# EAGLE schematic Nixie 3757 (EAGLE 6.5.0)
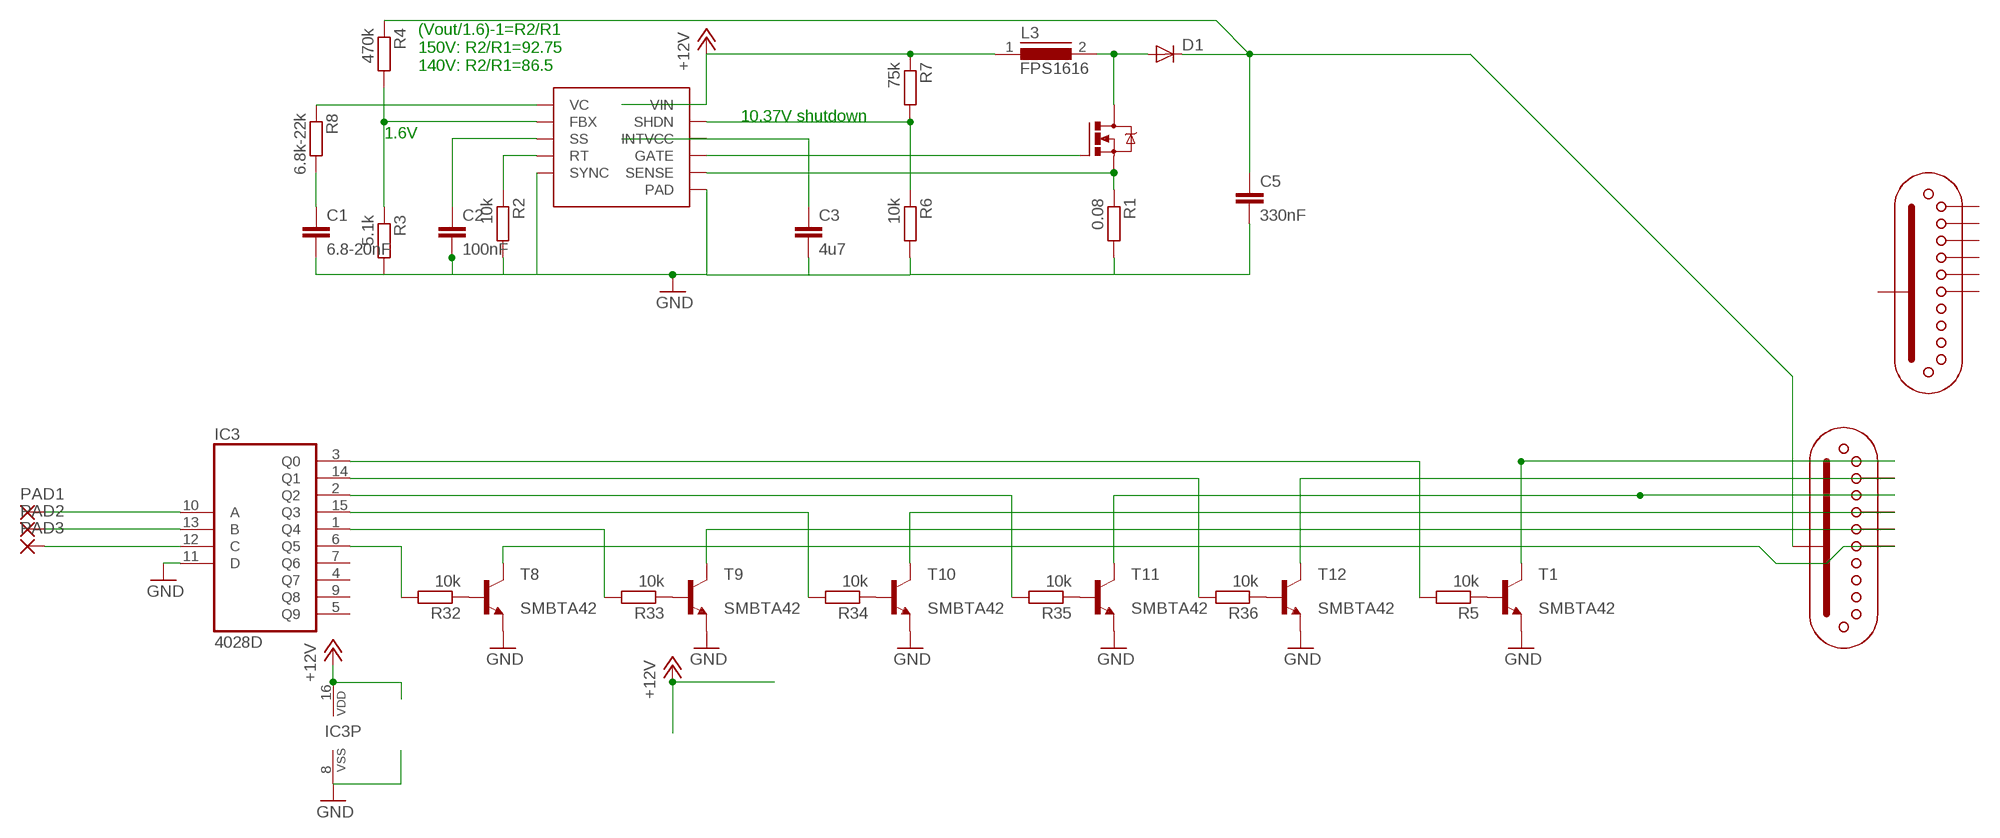
[diagram p0: schematic, sheet 1]

## Parts
C1  6.8-20nF  C-EUC0805K  [C0805K]
C2  100nF  C-EUC0805K  [C0805K]
C3  4u7  C-EUC0805K  [C0805K]
C5  330nF  C-EUC1812  [C1812]
D1  DIODE-DO219AB  [DO219AB]
IC3  4028D  [SO16]
L3  FPS1616  [1616FPS_22UH]
PAD1  1,6/0,8  [1,6/0,8]
PAD2  1,6/0,8  [1,6/0,8]
PAD3  1,6/0,8  [1,6/0,8]
Q4  N-MOSFET-TO252-DPAK  [TO252]
R1  0.08  R-EU_R0805  [R0805]
R2  10k  R-EU_R0805  [R0805]
R3  5.1k  R-EU_R0805  [R0805]
R4  470k  R-EU_R0805  [R0805]
R5  10k  R-EU_R0805  [R0805]
R6  10k  R-EU_R0805  [R0805]
R7  75k  R-EU_R0805  [R0805]
R8  6.8k-22k  R-EU_R0805  [R0805]
R32  10k  R-EU_R0805  [R0805]
R33  10k  R-EU_R0805  [R0805]
R34  10k  R-EU_R0805  [R0805]
R35  10k  R-EU_R0805  [R0805]
R36  10k  R-EU_R0805  [R0805]
T1  MMBTA42LT1-NPN-SOT23-BEC  [SOT23-BEC]
T8  MMBTA42LT1-NPN-SOT23-BEC  [SOT23-BEC]
T9  MMBTA42LT1-NPN-SOT23-BEC  [SOT23-BEC]
T10  MMBTA42LT1-NPN-SOT23-BEC  [SOT23-BEC]
T11  MMBTA42LT1-NPN-SOT23-BEC  [SOT23-BEC]
T12  MMBTA42LT1-NPN-SOT23-BEC  [SOT23-BEC]
U1  LT3757MSOP-10  [MSOP-10]
U$1  ZM1020  [ZM1020]
U$3  ZM1020  [ZM1020]

## Nets
+12V: IC3.16(VDD) L3.1 R7.1 U1.10(VIN)
GND: C1.2 C2.2 C3.2 C5.2 IC3.8(VSS) IC3.11(D) R1.2 R2.2 R3.2 R6.2 T1.E T8.E T9.E T10.E T11.E T12.E U1.5(SYNC) U1.PAD
N$1: C2.1 U1.3(SS)
N$2: IC3.10(A) PAD1.1(P)
N$3: IC3.13(B) PAD2.1(P)
N$4: D1.A L3.2 Q4.2(D)
N$5: R3.1 R4.2 U1.2(FBX)
N$6: IC3.3(Q0) R5.2
N$7: C1.1 R8.2
N$8: C5.1 D1.C R4.1 U$1.12(A)
N$9: Q4.1(G) U1.7(GATE)
N$10: R2.1 U1.4(RT)
N$11: IC3.12(C) PAD3.1(P)
N$12: R5.1 T1.B
N$13: T1.C U$1.11
N$14: Q4.3(S) R1.1 U1.6(SENSE)
N$15: R6.1 R7.2 U1.9(SHDN)
N$16: R8.1 U1.1(VC)
N$17: C3.1 U1.8(INTVCC)
N$18: R32.1 T8.B
N$37: IC3.14(Q1) R36.2
N$38: IC3.2(Q2) R35.2
N$39: T10.C U$1.3
N$50: T9.C U$1.4
N$51: R34.1 T10.B
N$56: R33.1 T9.B
N$57: R35.1 T11.B
N$61: IC3.6(Q5) R32.2
N$62: R36.1 T12.B
N$63: T8.C U$1.5
N$64: IC3.1(Q4) R33.2
N$65: IC3.15(Q3) R34.2
N$66: T11.C U$1.2
N$67: T12.C U$1.1
Unconnected: IC3.4(Q7) IC3.5(Q9) IC3.7(Q6) IC3.9(Q8) U$3.1 U$3.2 U$3.3 U$3.4 U$3.5 U$3.11 U$3.12(A)

## Notes on the sheet
- (Vout/1.6)-1=R2/R1
  150V: R2/R1=92.75
  140V: R2/R1=86.5
- 10.37V shutdown
- 1.6V

## Library data of the parts
C1-C3 C5 = rcl:C-EU: CAPACITOR, European symbol
D1 = diode_extended:DIODE-: DIODE
IC3 = 40xx:4028: BCD to decimal DECODER
L3 = inductor_power:FPS: High Power Density, High Efficiency, Shielded Inductors Source: coiltronics_dr_series.pdf
PAD1-PAD3 = wirepad:1,6/0,8: THROUGH-HOLE PAD
Q4 = N-MOSFET:N-MOSFET
R1-R8 R32-R36 = rcl:R-EU_: RESISTOR, European symbol
T1 T8-T12 = transistor:*-NPN-: NPN Transistror BF959 corrected 2008.03.06; T: SMBTA42
U1 = LT3757:LT3757
U$1 U$3 = ZM1020:ZM1020